# EAGLE design adapter (EAGLE 5.11)
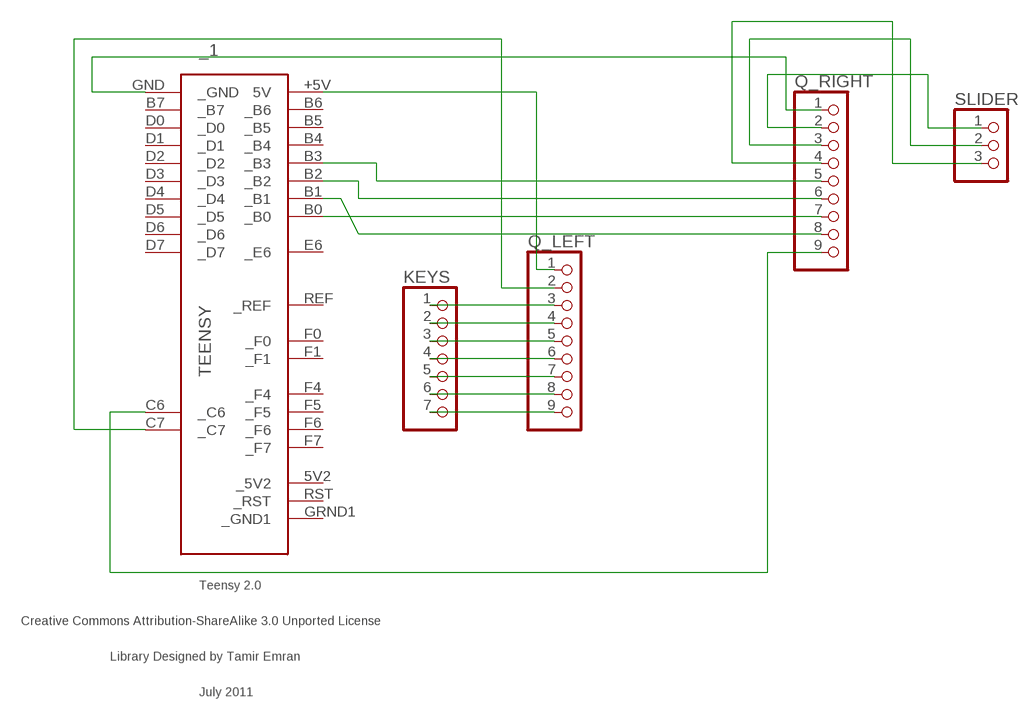
[diagram p0: schematic, sheet 1]

## Parts
_1  TEENSY  [TEENSY]
KEYS  PINHD-1X7  [1X07]
Q_LEFT  PINHD-1X9  [1X09]
Q_RIGHT  PINHD-1X9  [1X09]
SLIDER  PINHD-1X3  [1X03]

## Nets
N$1: _1.GND(_GND) Q_RIGHT.1
N$2: _1.+5V(5V) Q_LEFT.1
N$3: Q_RIGHT.2 SLIDER.1
N$4: Q_RIGHT.3 SLIDER.2
N$5: Q_RIGHT.4 SLIDER.3
N$6: _1.B3(_B3) Q_RIGHT.5
N$7: _1.B2(_B2) Q_RIGHT.6
N$8: _1.B0(_B0) Q_RIGHT.7
N$9: _1.B1(_B1) Q_RIGHT.8
N$10: _1.C6(_C6) Q_RIGHT.9
N$11: _1.C7(_C7) Q_LEFT.2
N$12: KEYS.1 Q_LEFT.3
N$13: KEYS.2 Q_LEFT.4
N$14: KEYS.3 Q_LEFT.5
N$15: KEYS.4 Q_LEFT.6
N$16: KEYS.5 Q_LEFT.7
N$17: KEYS.6 Q_LEFT.8
N$18: KEYS.7 Q_LEFT.9
Unconnected: _1.5V2(_5V2) _1.B4(_B4) _1.B5(_B5) _1.B6(_B6) _1.B7(_B7) _1.D0(_D0) _1.D1(_D1) _1.D2(_D2) _1.D3(_D3) _1.D4(_D4) _1.D5(_D5) _1.D6(_D6) _1.D7(_D7) _1.E6(_E6) _1.F0(_F0) _1.F1(_F1) _1.F4(_F4) _1.F5(_F5) _1.F6(_F6) _1.F7(_F7) _1.GRND1(_GND1) _1.REF(_REF) _1.RST(_RST)

## Library data of the parts
_1 = teensy:TEENSY: Teensy 2.0 Original Design by Clint Fisher Modified Design by Tamir Emran Licensed Under Creative Commons Attribution-ShareAlike 3.0 Unported (CC BY-SA 3.0)
KEYS = pinhead:PINHD-1X7: PIN HEADER
Q_LEFT Q_RIGHT = pinhead:PINHD-1X9: PIN HEADER
SLIDER = pinhead:PINHD-1X3: PIN HEADER

## Board
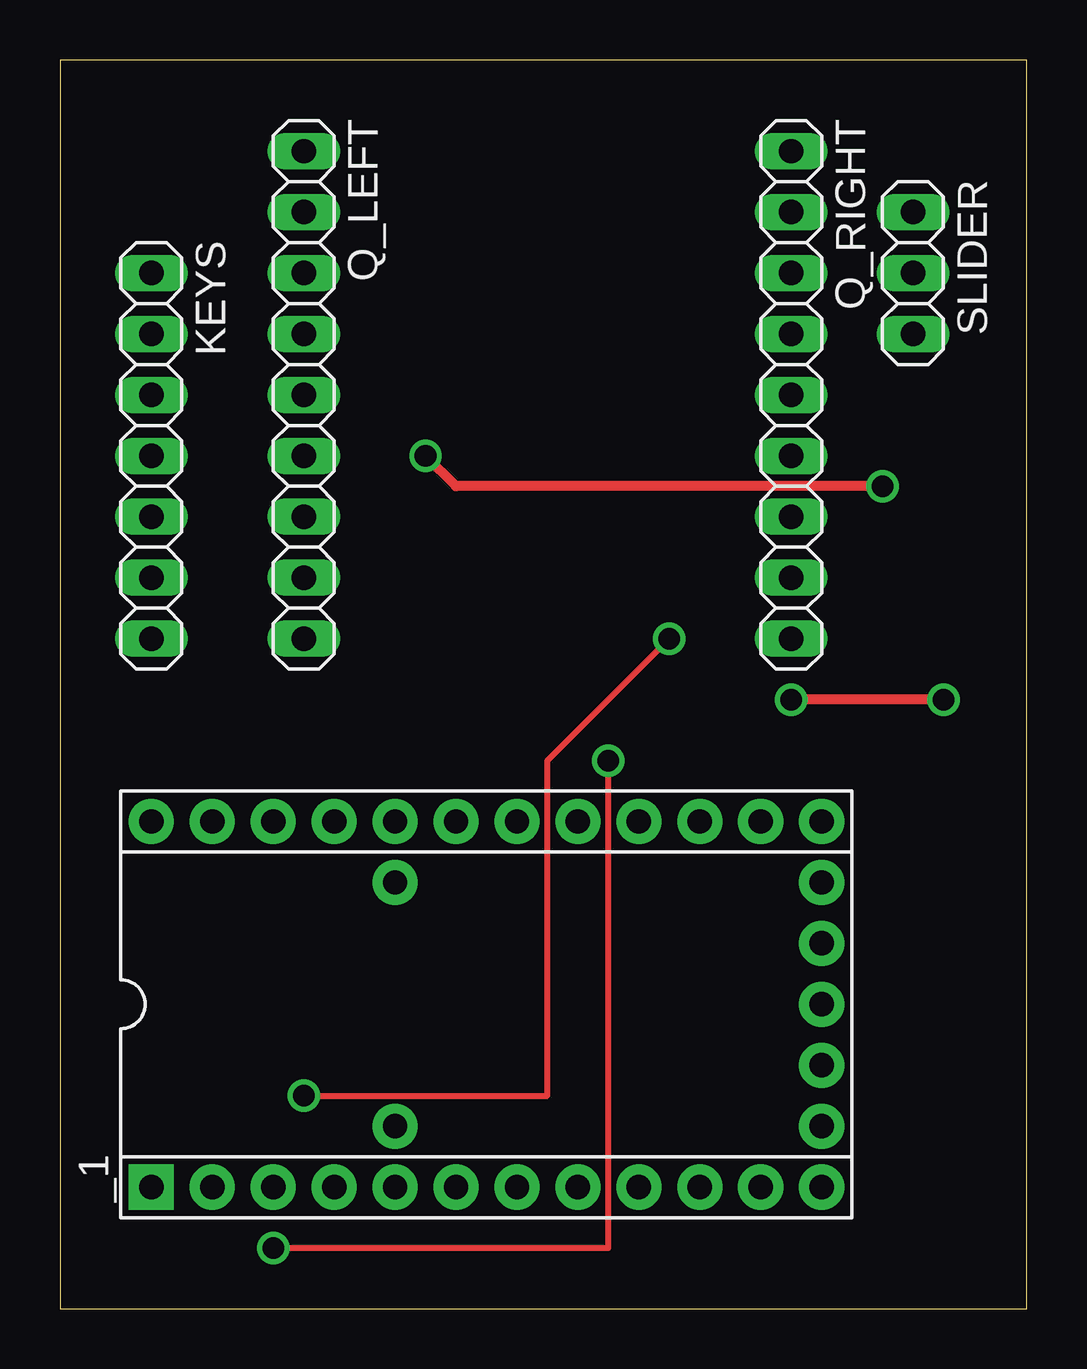
[diagram p1: board, top side]
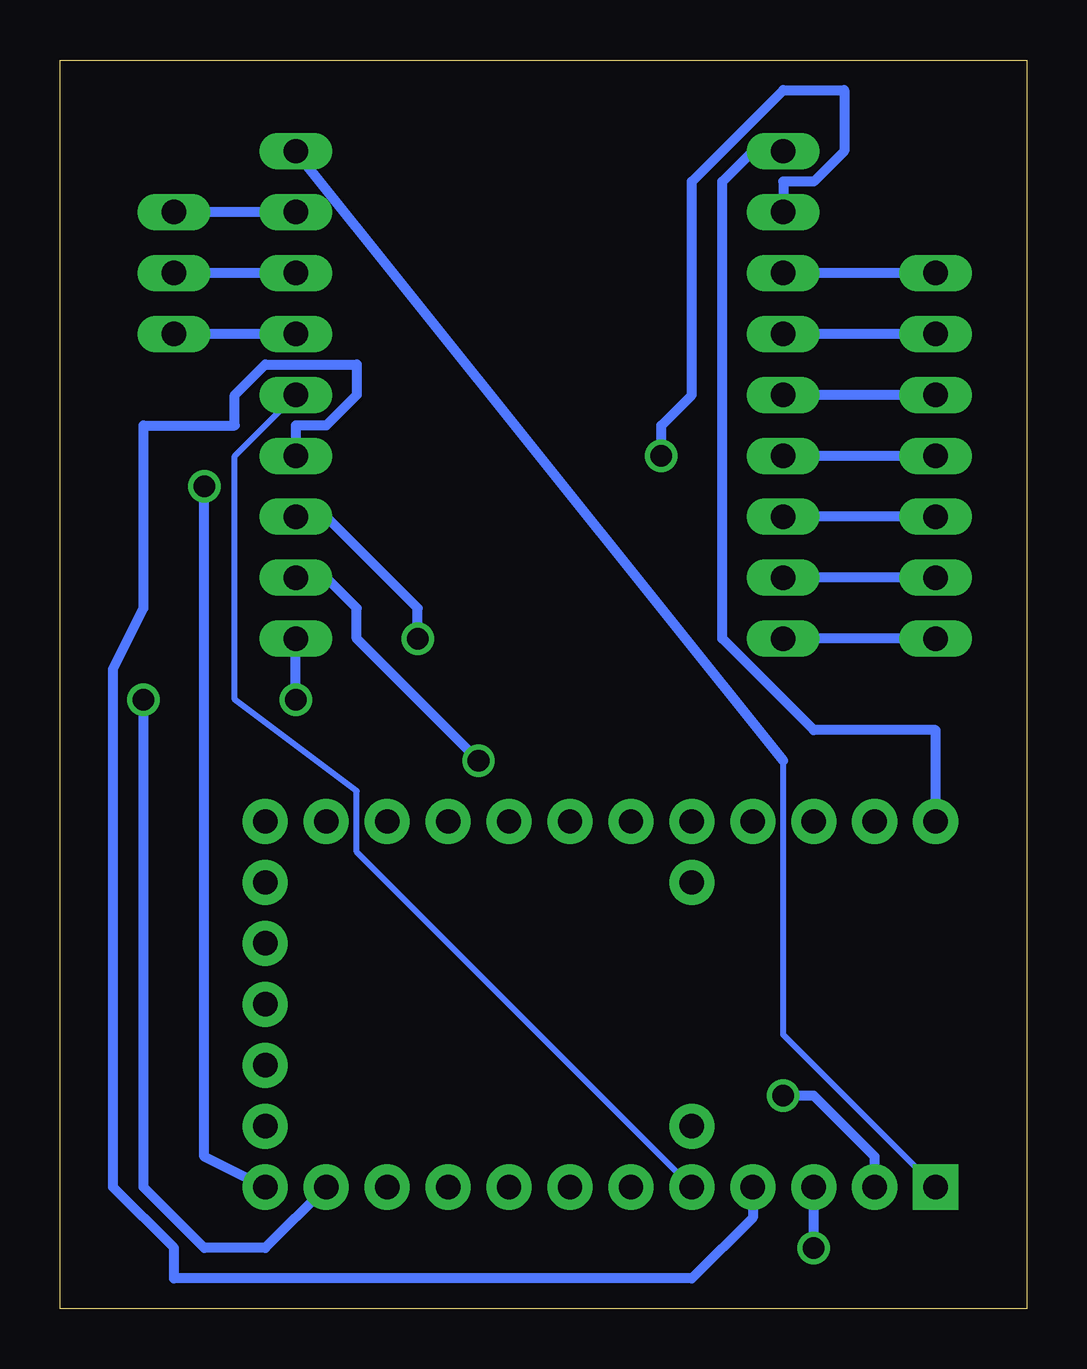
[diagram p2: board, bottom side, seen from below]

Size 40.31 x 52.06 mm. Coordinates in mm from the lower left corner, seen from the top.
Outline: 0,0 40.31,0 40.31,52.06 0,52.06 0,0
Copper layers (1*16): Top 0.035mm / dielectric 1.5mm / Bottom 0.035mm
Design rules "default": minimum track width 10mil, minimum drill 24mil, track to track 8mil, track to pad 8mil, pad to pad 8mil, via to via 8mil, smd to smd 8mil, copper to edge 40mil, drill to drill 8mil, minimum pad ring 10mil, minimum via ring 8mil, stop-mask expansion 4mil, vias tented up to drill 0mil, thermal gap 10mil

### Footprints (pad centres in the part's own frame; a part is rotated, then mirrored left to right if it is on the bottom)
TEENSY = drill 1.016 pad 1.88 round: 5V2 13.97,-2.54; +5V -13.97,7.62; B0 -11.43,-7.62; B1 -8.89,-7.62; B2 -6.35,-7.62; B3 -3.81,-7.62; B4 8.89,7.62; B5 6.35,7.62; B6 3.81,7.62; B7 -1.27,-7.62; C6 11.43,-7.62; C7 13.97,-7.62; D0 1.27,-7.62; D1 3.81,-7.62; D2 6.35,-7.62; D3 8.89,-7.62; D4 13.97,5.08; D5 13.97,-5.08; D6 13.97,7.62; D7 11.43,7.62; E6 -3.81,-5.08; F0 -11.43,7.62; F1 -8.89,7.62; F4 -6.35,7.62; F5 -3.81,7.62; F6 -1.27,7.62; F7 1.27,7.62; GRND1 13.97,0; REF -3.81,5.08; RST 13.97,2.54 | drill 1.016 pad 1.88 square: GND -13.97,-7.62
1X07 = drill 1.016 long: 1 -7.62,0; 2 -5.08,0; 3 -2.54,0; 4 0,0; 5 2.54,0; 6 5.08,0; 7 7.62,0
1X09 = drill 1.016 long: 1 -10.16,0; 2 -7.62,0; 3 -5.08,0; 4 -2.54,0; 5 0,0; 6 2.54,0; 7 5.08,0; 8 7.62,0; 9 10.16,0
1X03 = drill 1.016 long: 1 -2.54,0; 2 0,0; 3 2.54,0

### Placement (x,y rotation side)
_1  17.78,12.7 0 top
KEYS  3.81,35.56 270 top
Q_LEFT  10.16,38.1 270 top
Q_RIGHT  30.48,38.1 270 top
SLIDER  35.56,43.18 270 top

### Tracks (layer width: path | path; a pad name or v marks a point on that pad's centre or on a via)
N$1
  Bottom 0.254: 10.16,22.86 10.16,11.43 _1.GND
  Bottom 0.406: 10.16,22.86 Q_RIGHT.1
N$2
  Bottom 0.406: _1.+5V 3.81,24.13 8.89,24.13 12.7,27.94 12.7,46.99 11.43,48.26 Q_LEFT.1
N$3
  Bottom 0.406: Q_RIGHT.2 SLIDER.1
N$4
  Bottom 0.406: Q_RIGHT.3 SLIDER.2
N$5
  Bottom 0.406: Q_RIGHT.4 SLIDER.3
N$6
  Bottom 0.254: Q_RIGHT.5 33.02,35.56 33.02,25.4 27.94,21.59 27.94,19.05 _1.B3
N$7
  Bottom 0.406: _1.B2 11.43,3.81 13.97,1.27 35.56,1.27 35.56,2.54 38.1,5.08 38.1,26.67 36.83,29.21 36.83,36.83 33.02,36.83 33.02,38.1 31.75,39.37 27.94,39.37 27.94,38.1 29.21,36.83 30.48,36.83 Q_RIGHT.6
N$8  (via drill 0.9)
  Top 0.254: v25.4,27.94 20.32,22.86 20.32,8.89 v10.16,8.89
  Bottom 0.406: v25.4,27.94 25.4,29.21 29.21,33.02 Q_RIGHT.7 | v10.16,8.89 8.89,8.89 6.35,6.35 _1.B0
N$9  (via drill 0.9)
  Top 0.254: v22.86,22.86 22.86,2.54 v8.89,2.54
  Bottom 0.406: v8.89,2.54 _1.B1 | Q_RIGHT.8 29.21,30.48 27.94,29.21 27.94,27.94 v22.86,22.86
N$10  (via drill 0.9)
  Top 0.406: v36.83,25.4 v30.48,25.4
  Bottom 0.406: v30.48,25.4 Q_RIGHT.9 | _1.C6 31.75,2.54 34.29,2.54 36.83,5.08 v36.83,25.4
N$11  (via drill 0.9)
  Top 0.406: v15.24,35.56 16.51,34.29 v34.29,34.29
  Bottom 0.406: _1.C7 34.29,6.35 v34.29,34.29 | v15.24,35.56 15.24,36.83 13.97,38.1 13.97,46.99 10.16,50.8 7.62,50.8 7.62,48.26 8.89,46.99 10.16,46.99 Q_LEFT.2
N$12
  Bottom 0.406: KEYS.1 Q_LEFT.3
N$13
  Bottom 0.406: KEYS.2 Q_LEFT.4
N$14
  Bottom 0.406: KEYS.3 Q_LEFT.5
N$15
  Bottom 0.406: KEYS.4 Q_LEFT.6
N$16
  Bottom 0.406: KEYS.5 Q_LEFT.7
N$17
  Bottom 0.406: KEYS.6 Q_LEFT.8
N$18
  Bottom 0.406: KEYS.7 Q_LEFT.9